# EAGLE design Circlez8a_v2 (EAGLE 6.3)
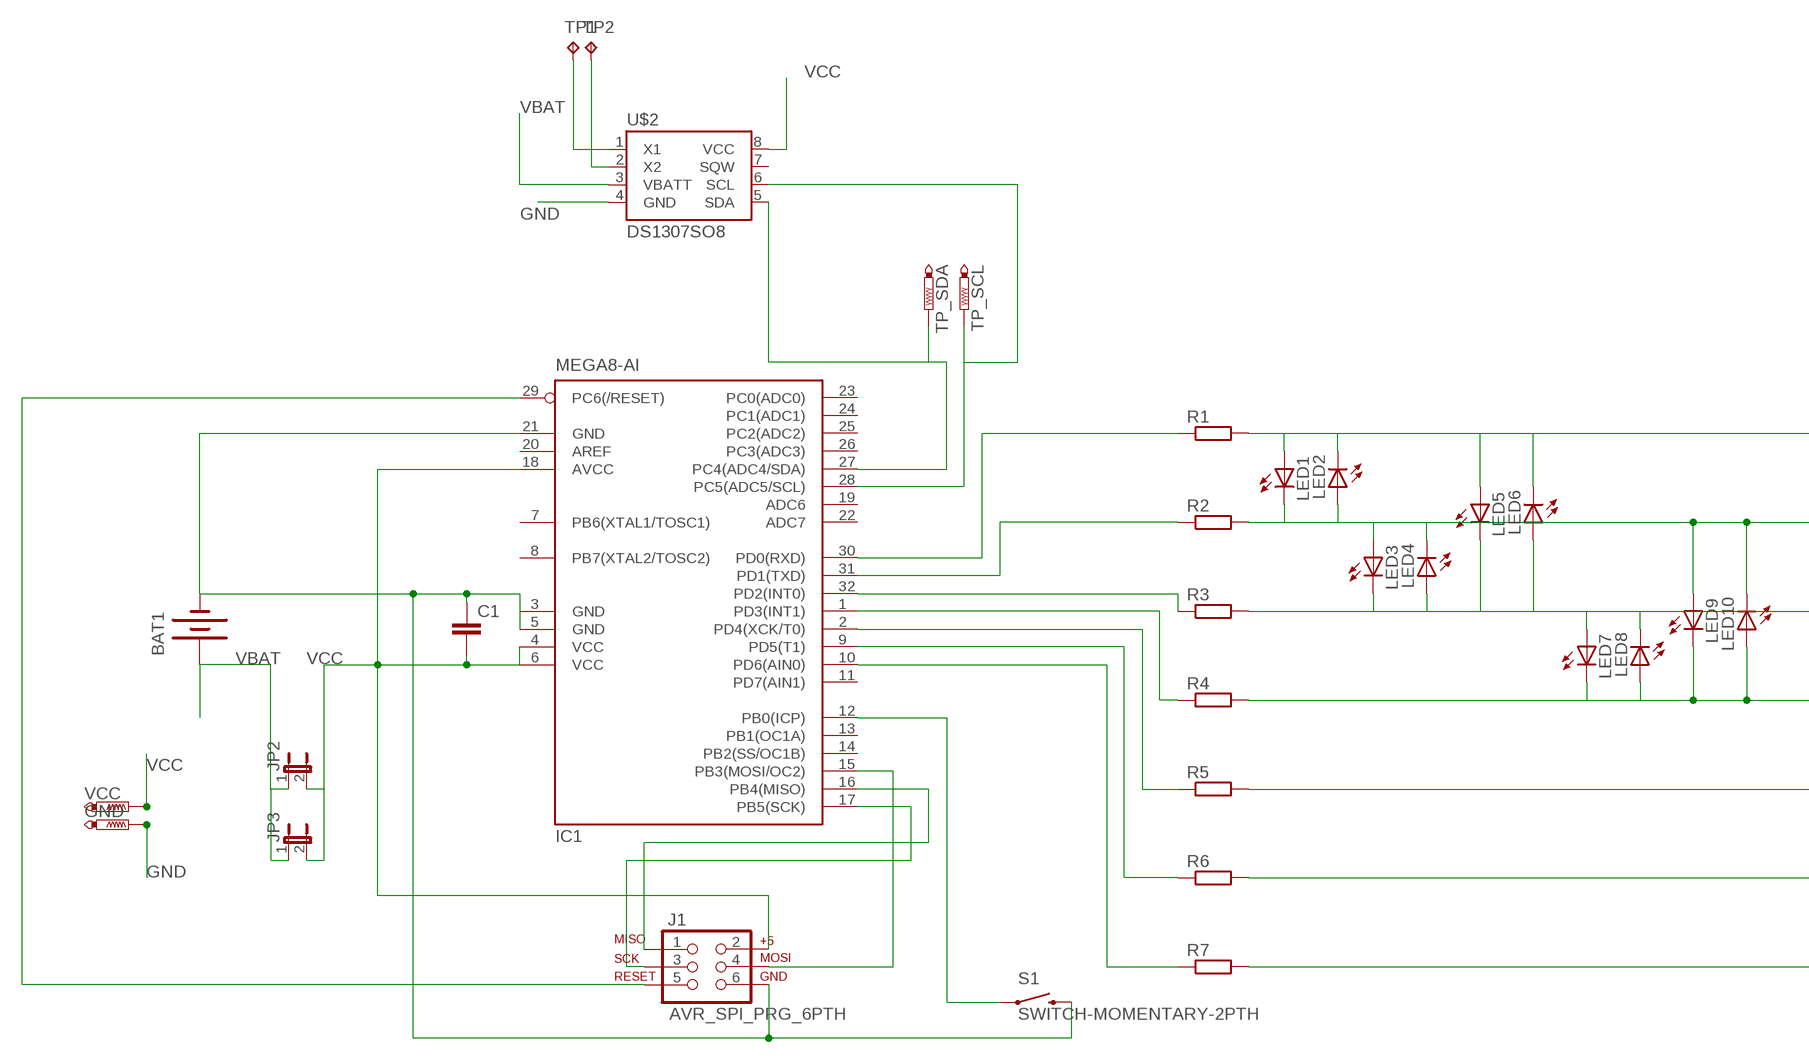
[diagram p0: schematic, sheet 1, part 1 of 2]
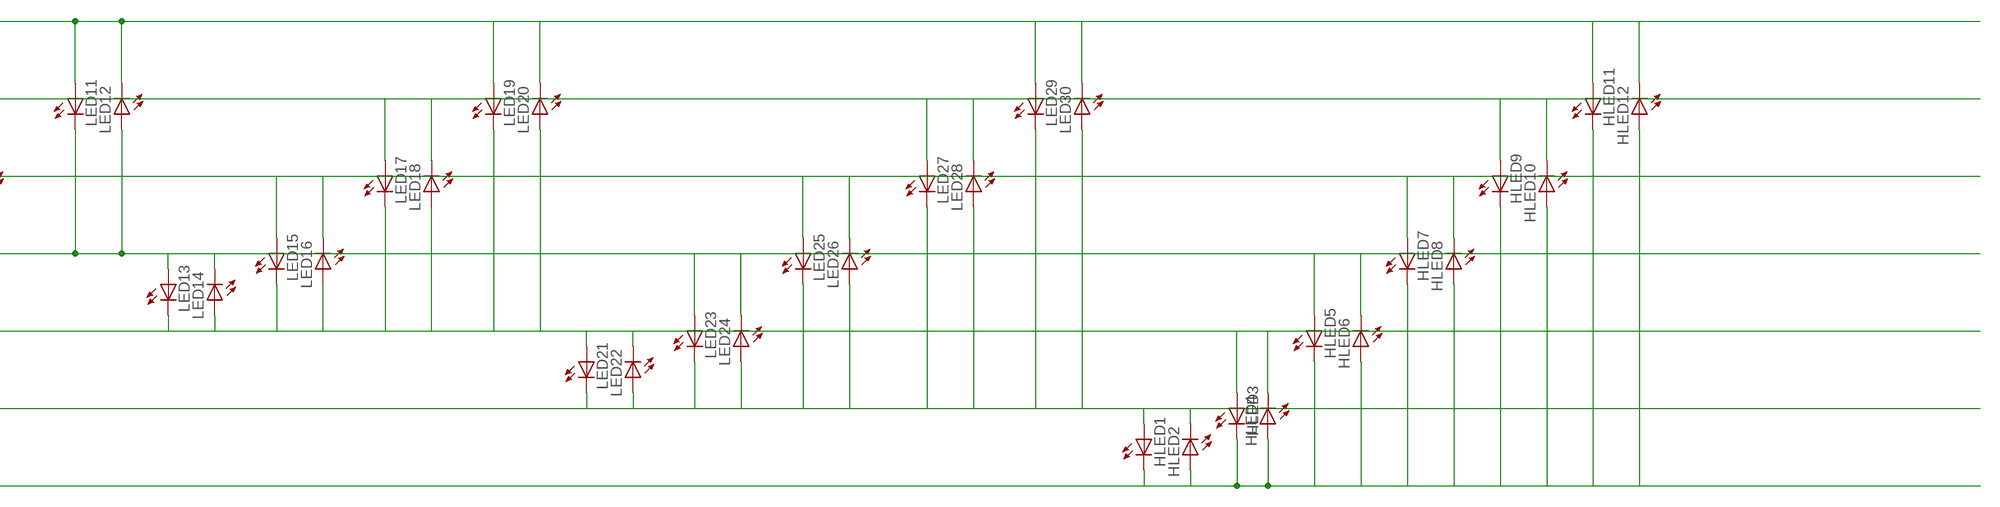
[diagram p1: schematic, sheet 1, part 2 of 2]

## Parts
BAT1  BATTERY20PTH  [BATTCOM_20MM_PTH]
C1  C-EU025-024X044  [C025-024X044]
GND  PTR1TP15SQ  [TP15SQ]
HLED1  LEDCHIP-LED0603  [CHIP-LED0603]
HLED2  LEDCHIP-LED0603  [CHIP-LED0603]
HLED3  LEDCHIP-LED0603  [CHIP-LED0603]
HLED4  LEDCHIP-LED0603  [CHIP-LED0603]
HLED5  LEDCHIP-LED0603  [CHIP-LED0603]
HLED6  LEDCHIP-LED0603  [CHIP-LED0603]
HLED7  LEDCHIP-LED0603  [CHIP-LED0603]
HLED8  LEDCHIP-LED0603  [CHIP-LED0603]
HLED9  LEDCHIP-LED0603  [CHIP-LED0603]
HLED10  LEDCHIP-LED0603  [CHIP-LED0603]
HLED11  LEDCHIP-LED0603  [CHIP-LED0603]
HLED12  LEDCHIP-LED0603  [CHIP-LED0603]
IC1  MEGA8-AI  [TQFP32-08]
J1  AVR_SPI_PRG_6PTH  [2X3]
JP2  JUMPER-2SMD-NO  [SJ_2S-NO]
JP3  JUMPER-2PTH  [1X02]
LED1  LEDCHIPLED_0603  [CHIPLED_0603]
LED2  LEDCHIPLED_0603  [CHIPLED_0603]
LED3  LEDCHIPLED_0603  [CHIPLED_0603]
LED4  LEDCHIPLED_0603  [CHIPLED_0603]
LED5  LEDCHIPLED_0603  [CHIPLED_0603]
LED6  LEDCHIPLED_0603  [CHIPLED_0603]
LED7  LEDCHIPLED_0603  [CHIPLED_0603]
LED8  LEDCHIPLED_0603  [CHIPLED_0603]
LED9  LEDCHIPLED_0603  [CHIPLED_0603]
LED10  LEDCHIPLED_0603  [CHIPLED_0603]
LED11  LEDCHIPLED_0603  [CHIPLED_0603]
LED12  LEDCHIPLED_0603  [CHIPLED_0603]
LED13  LEDCHIPLED_0603  [CHIPLED_0603]
LED14  LEDCHIPLED_0603  [CHIPLED_0603]
LED15  LEDCHIPLED_0603  [CHIPLED_0603]
LED16  LEDCHIPLED_0603  [CHIPLED_0603]
LED17  LEDCHIPLED_0603  [CHIPLED_0603]
LED18  LEDCHIPLED_0603  [CHIPLED_0603]
LED19  LEDCHIPLED_0603  [CHIPLED_0603]
LED20  LEDCHIPLED_0603  [CHIPLED_0603]
LED21  LEDCHIPLED_0603  [CHIPLED_0603]
LED22  LEDCHIPLED_0603  [CHIPLED_0603]
LED23  LEDCHIPLED_0603  [CHIPLED_0603]
LED24  LEDCHIPLED_0603  [CHIPLED_0603]
LED25  LEDCHIPLED_0603  [CHIPLED_0603]
LED26  LEDCHIPLED_0603  [CHIPLED_0603]
LED27  LEDCHIPLED_0603  [CHIPLED_0603]
LED28  LEDCHIPLED_0603  [CHIPLED_0603]
LED29  LEDCHIPLED_0603  [CHIPLED_0603]
LED30  LEDCHIPLED_0603  [CHIPLED_0603]
R1  R-EU_R1206  [R1206]
R2  R-EU_R1206  [R1206]
R3  R-EU_R1206  [R1206]
R4  R-EU_R1206  [R1206]
R5  R-EU_R1206  [R1206]
R6  R-EU_R1206  [R1206]
R7  R-EU_R1206  [R1206]
S1  SWITCH-MOMENTARY-2PTH  [TACTILE-PTH]
TP1  TPTP13SQ  [TP13SQ]
TP2  TPTP13SQ  [TP13SQ]
TP_SCL  PTR1TP09SQ  [TP09SQ]
TP_SDA  PTR1TP09SQ  [TP09SQ]
U$2  DS1307SO8  [SO08]
VCC  PTR1TP15SQ  [TP15SQ]

## Nets
GND: BAT1.2(-) C1.1 GND.TP IC1.3(GND) IC1.5(GND) IC1.21(GND) J1.6 S1.3 U$2.4(GND)
N$1: IC1.12(PB0(ICP)) S1.1
N$2: HLED11.A HLED12.C LED1.A LED2.C LED5.A LED6.C LED11.A LED12.C LED19.A LED20.C LED29.A LED30.C R1.2
N$3: IC1.16(PB4(MISO)) J1.1
N$4: IC1.17(PB5(SCK)) J1.3
N$5: IC1.15(PB3(MOSI/OC2)) J1.4
N$6: IC1.29(PC6(/RESET)) J1.5
N$8: HLED9.A HLED10.C LED1.C LED2.A LED3.A LED4.C LED9.A LED10.C LED17.A LED18.C LED27.A LED28.C R2.2
N$10: HLED5.A HLED6.C LED7.C LED8.A LED9.C LED10.A LED11.C LED12.A LED13.A LED14.C LED23.A LED24.C R4.2
N$11: HLED3.A HLED4.C LED13.C LED14.A LED15.C LED16.A LED17.C LED18.A LED19.C LED20.A LED21.A LED22.C R5.2
N$12: IC1.28(PC5(ADC5/SCL)) TP_SCL.TP U$2.6(SCL)
N$13: HLED1.A HLED2.C LED21.C LED22.A LED23.C LED24.A LED25.C LED26.A LED27.C LED28.A LED29.C LED30.A R6.2
N$14: HLED1.C HLED2.A HLED3.C HLED4.A HLED5.C HLED6.A HLED7.C HLED8.A HLED9.C HLED10.A HLED11.C HLED12.A R7.2
N$15: IC1.30(PD0(RXD)) R1.1
N$16: IC1.31(PD1(TXD)) R2.1
N$17: IC1.32(PD2(INT0)) R3.1
N$18: IC1.1(PD3(INT1)) R4.1
N$19: IC1.2(PD4(XCK/T0)) R5.1
N$20: IC1.9(PD5(T1)) R6.1
N$21: IC1.10(PD6(AIN0)) R7.1
N$22: TP1.TP U$2.1(X1)
N$23: TP2.TP U$2.2(X2)
N$24: IC1.27(PC4(ADC4/SDA)) TP_SDA.TP U$2.5(SDA)
N$27: HLED7.A HLED8.C LED3.C LED4.A LED5.C LED6.A LED7.A LED8.C LED15.A LED16.C LED25.A LED26.C R3.2
VBAT: BAT1.1(+) JP2.1 JP3.1 U$2.3(VBATT)
VCC: C1.2 IC1.4(VCC) IC1.6(VCC) IC1.18(AVCC) J1.2 JP2.2 JP3.2 U$2.8(VCC) VCC.TP
Unconnected: IC1.7(PB6(XTAL1/TOSC1)) IC1.8(PB7(XTAL2/TOSC2)) IC1.11(PD7(AIN1)) IC1.13(PB1(OC1A)) IC1.14(PB2(SS/OC1B)) IC1.19(ADC6) IC1.20(AREF) IC1.22(ADC7) IC1.23(PC0(ADC0)) IC1.24(PC1(ADC1)) IC1.25(PC2(ADC2)) IC1.26(PC3(ADC3)) U$2.7(SQW)

## Library data of the parts
BAT1 = SparkFun:BATTERY: Battery Holders Various common sizes : AA, AAA, 20mm coin cell and 12mm coin cell.
C1 = resistor:C-EU: CAPACITOR, European symbol
GND TP_SCL TP_SDA VCC = testpad:PTR1: TEST PIN
HLED1-HLED12 LED1-LED30 = led:LED: LED OSRAM: - CHIPLED LG R971, LG N971, LY N971, LG Q971, LY Q971, LO R971, LY R971 LH N974, LH R974 LS Q976, LO Q976, LY Q976 LO Q996 - Hyper CHIPLED LW Q18S LB Q993, LB Q99A, LB R99A - SideLED LS A670, LO A670, LY A670, LG A670, LP A670 LB A673, LV A673, LT A673, LW A673 LH A674 LY A675 LS A676, LA A676, LO A676, LY A676, LW A676 LS A679, LY A679, LG A679 - Hyper Micro SIDELED® LS Y876, LA Y876, LO Y876, LY Y876 LT Y87S - SmartLED LW L88C, LW L88S LB L89C, LB L89S, LG L890 LS L89K, LO L89K, LY L89K LS L896, LA L896, LO L896, LY L896 - TOPLED LS T670, LO T670, LY T670, LG T670, LP T670 LSG T670, LSP T670, LSY T670, LOP T670, LYG T670 LG T671, LOG T671, LSG T671 LB T673, LV T673, LT T673, LW T673 LH T674 LS T676, LA T676, LO T676, LY T676, LB T676, LH T676, LSB T676, LW T676 LB T67C, LV T67C, LT T67C, LS T67K, LO T67K, LY T67K, LW E67C LS E67B, LA E67B, LO E67B, LY E67B, LB E67C, LV E67C, LT E67C LW T67C LS T679, LY T679, LG T679 LS T770, LO T770, LY T770, LG T770, LP T770 LB T773, LV T773, LT T773, LW T773 LH T774 LS E675, LA E675, LY E675, LS T675 LS T776, LA T776, LO T776, LY T776, LB T776 LHGB T686 LT T68C, LB T68C - Hyper Mini TOPLED® LB M676 - Mini TOPLED Santana® LG M470 LS M47K, LO M47K, LY M47K Source: http://www.osram.convergy.de LUXEON: - LUMILED® LXK2-PW12-R00, LXK2-PW12-S00, LXK2-PW14-U00, LXK2-PW14-V00 LXK2-PM12-R00, LXK2-PM12-S00, LXK2-PM14-U00 LXK2-PE12-Q00, LXK2-PE12-R00, LXK2-PE12-S00, LXK2-PE14-T00, LXK2-PE14-U00 LXK2-PB12-K00, LXK2-PB12-L00, LXK2-PB12-M00, LXK2-PB14-N00, LXK2-PB14-P00, LXK2-PB14-Q00 LXK2-PR12-L00, LXK2-PR12-M00, LXK2-PR14-Q00, LXK2-PR14-R00 LXK2-PD12-Q00, LXK2-PD12-R00, LXK2-PD12-S00 LXK2-PH12-R00, LXK2-PH12-S00 LXK2-PL12-P00, LXK2-PL12-Q00, LXK2-PL12-R00 Source: www.luxeon.com KINGBRIGHT: KA-3528ASYC Source: www.kingbright.com
IC1 = atmel:MEGA8: MICROCONTROLLER 8 Kbytes FLASH, 1 kbytes SRAM, 512 bytes EEPROM, USART, 6-channel 10 bit ADC, 2-channel 8 bit ADC Pin compatible with Atmega48, ATMega88, ATMega168 Source: avr.lbr; MPN: ATMEGA8-16AU; OC_FARNELL: 9171371; OC_NEWARK: 73M8863
J1 = SparkFun-Connectors:AVR_SPI_PRG_6: AVR ISP 6 Pin This is the reduced ISP connector for AVR programming. Common on Arduino. This footprint will take up less PCB space and can be used with a 10-pin to 6-pin adapter such as SKU: BOB-08508
JP2 JP3 = SparkFun-Passives:JUMPER-2: Jumper Basic 0.1" spaced jumper. Use with breakaway headers.
R1-R7 = resistor:R-EU_: RESISTOR, European symbol
S1 = SparkFun-Electromechanical:SWITCH-MOMENTARY-2: Various NO switches- pushbuttons, reed, etc
TP1 TP2 = testpad:TP: Test pad
U$2 = SparkFun-FreqCtrl:DS1307: I2C real-time clock with battery backup.

## Board
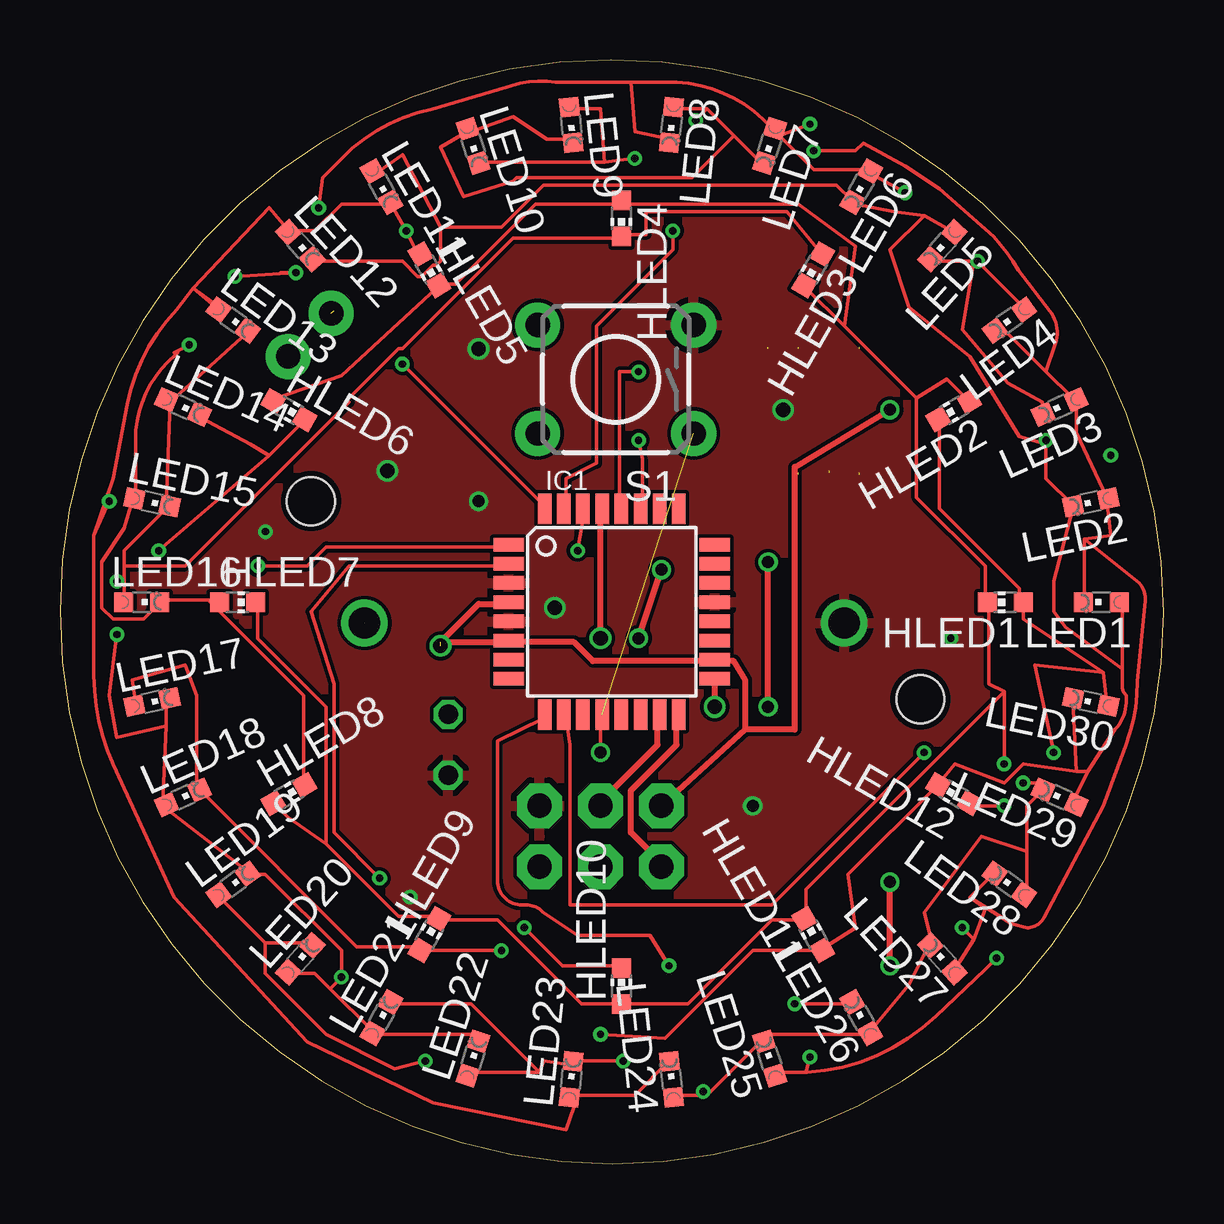
[diagram p2: board, top side]
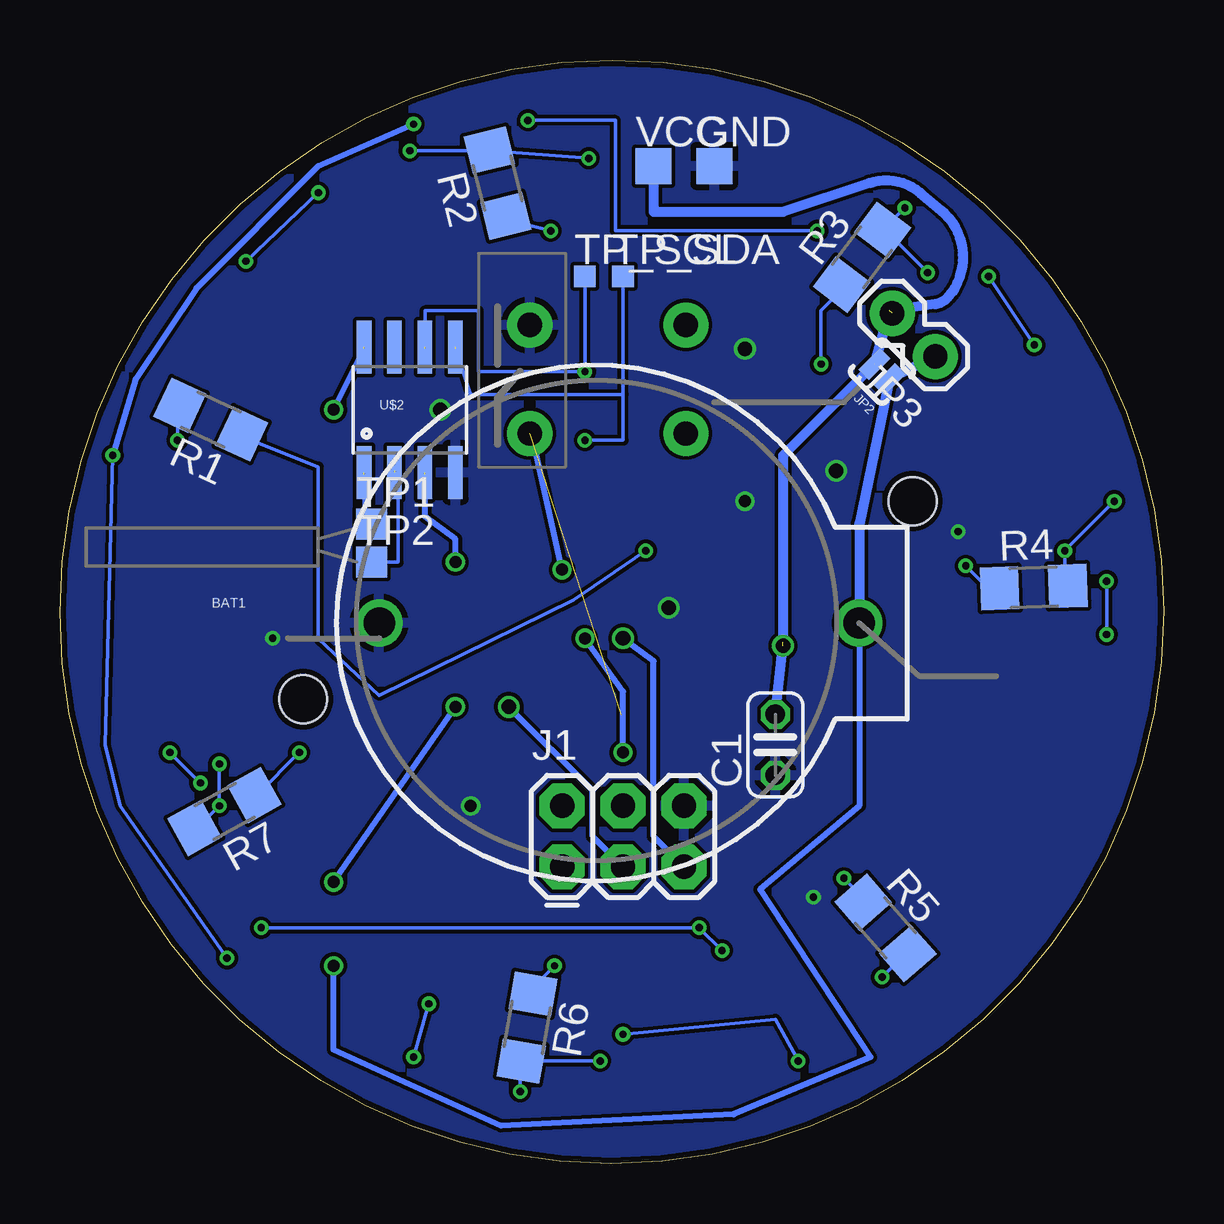
[diagram p3: board, bottom side, seen from below]

Size 46 x 46 mm. Coordinates in mm from the lower left corner, seen from the top.
Outline: 0,23.03 arc90 23.03,0 arc90 46,22.97 arc90 22.97,46 arc90 0,23.03
Copper layers (1*2*15*16): Top 0.035mm / dielectric 0.2mm / layer 2 0.0175mm / dielectric 1.1mm / layer 15 0.0175mm / dielectric 0.2mm / Bottom 0.035mm
Design rules "SeeedStudio_DRU_no_angle_20130527": minimum track width 6mil, minimum drill 12mil, track to track 6mil, track to pad 6mil, pad to pad 6mil, via to via 6mil, smd to smd 0mil, copper to edge 10mil, drill to drill 10mil, minimum pad ring 6mil, minimum via ring 6mil, stop-mask expansion 2mil, vias tented up to drill 25mil, thermal gap 10mil
Holes 2 mm at 35.87,19.35 10.46,27.61

### Footprints (pad centres in the part's own frame; a part is rotated, then mirrored left to right if it is on the bottom)
BATTCOM_20MM_PTH = drill 1.3: 1 20,0; 2 0,0
C025-024X044 = drill 0.813 octagon: 1 -1.27,0; 2 1.27,0
TP15SQ = smd 1.5 x 1.5: TP 0,0
CHIP-LED0603 = smd 0.8 x 0.8: A 0,-0.75; C 0,0.75
TQFP32-08 = smd 1.27 x 0.559: 1 -4.293,2.8; 2 -4.293,2; 3 -4.293,1.2; 4 -4.293,0.4; 5 -4.293,-0.4; 6 -4.293,-1.2; 7 -4.293,-2; 8 -4.293,-2.8; 17 4.293,-2.8; 18 4.293,-2; 19 4.293,-1.2; 20 4.293,-0.4; 21 4.293,0.4; 22 4.293,1.2; 23 4.293,2; 24 4.293,2.8 | smd 0.559 x 1.27: 9 -2.8,-4.293; 10 -2,-4.293; 11 -1.2,-4.293; 12 -0.4,-4.293; 13 0.4,-4.293; 14 1.2,-4.293; 15 2,-4.293; 16 2.8,-4.293; 25 2.8,4.293; 26 2,4.293; 27 1.2,4.293; 28 0.4,4.293; 29 -0.4,4.293; 30 -1.2,4.293; 31 -2,4.293; 32 -2.8,4.293
2X3 = drill 1.016 pad 1.88 octagon: 1 0,0; 2 0,2.54; 3 2.54,0; 4 2.54,2.54; 5 5.08,0; 6 5.08,2.54
SJ_2S-NO = smd 0.635 x 1.27: 1 -0.45,0; 2 0.45,0
1X02 = drill 1.016 pad 1.88: 1 0,0; 2 2.54,0
CHIPLED_0603 = smd 0.8 x 0.8: A 0,-0.75; C 0,0.75
R1206 = smd 1.6 x 1.803: 1 -1.422,0; 2 1.422,0
TACTILE-PTH = drill 1.016 pad 1.88: 1 -3.251,2.261; 2 3.251,2.261; 3 -3.251,-2.261; 4 3.251,-2.261
TP13SQ = smd 1.3 x 1.3: TP 0,0
TP09SQ = smd 0.9 x 0.9: TP 0,0
SO08 = smd 0.61 x 2.21: 1 -1.905,-2.616; 2 -0.635,-2.616; 3 0.635,-2.616; 4 1.905,-2.616; 5 1.905,2.616; 6 0.635,2.616; 7 -0.635,2.616; 8 -1.905,2.616

### Placement (x,y rotation side)
BAT1  32.69,22.53 0 bottom
C1  16.18,17.45 90 bottom
GND  18.72,41.58 0 bottom
HLED1  39.4,23.4 90 top
HLED2  37.26,31.4 120 top
HLED3  31.4,37.26 150 top
HLED4  23.4,39.4 180 top
HLED5  15.4,37.26 210 top
HLED6  9.54,31.4 240 top
HLED7  7.4,23.4 270 top
HLED8  9.54,15.4 300 top
HLED9  15.4,9.54 330 top
HLED10  23.4,7.4 0 top
HLED11  31.4,9.54 30 top
HLED12  37.26,15.4 60 top
IC1  23,23 0 top
J1  25.07,12.37 0 bottom
JP2  11.74,33.01 135 bottom
JP3  9.51,33.64 135 bottom
LED1  43.4,23.4 90 top
LED2  42.96,27.56 102 top
LED3  41.67,31.53 114 top
LED4  39.58,35.16 126 top
LED5  36.78,38.26 138 top
LED6  33.4,40.72 150 top
LED7  29.58,42.42 162 top
LED8  25.49,43.29 174 top
LED9  21.31,43.29 186 top
LED10  17.22,42.42 198 top
LED11  13.4,40.72 210 top
LED12  10.02,38.26 222 top
LED13  7.22,35.16 234 top
LED14  5.13,31.53 246 top
LED15  3.84,27.56 258 top
LED16  3.4,23.4 270 top
LED17  3.84,19.24 282 top
LED18  5.13,15.27 294 top
LED19  7.22,11.64 306 top
LED20  10.02,8.54 318 top
LED21  13.4,6.08 330 top
LED22  17.22,4.38 342 top
LED23  21.31,3.51 354 top
LED24  25.49,3.51 6 top
LED25  29.58,4.38 18 top
LED26  33.4,6.08 30 top
LED27  36.78,8.54 42 top
LED28  39.58,11.64 54 top
LED29  41.67,15.27 66 top
LED30  42.96,19.24 78 top
R1  39.71,31.01 155 bottom
R2  27.75,40.87 104 bottom
R3  12.57,37.78 53 bottom
R4  5.41,24.03 2 bottom
R5  11.59,9.82 311 bottom
R6  26.53,5.67 260 bottom
R7  39.14,14.67 209 bottom
S1  23.16,32.69 180 top
TP1  33.01,26.66 0 bottom
TP2  33.01,25.07 0 bottom
TP_SCL  24.12,36.98 0 bottom
TP_SDA  22.53,36.98 0 bottom
U$2  31.42,31.42 0 bottom
VCC  21.26,41.58 0 bottom

### Tracks (layer width: path | path; a pad name or v marks a point on that pad's centre or on a via)
GND  (via drill 0.3, 0.5, 0.6)
  other vias: 13.64,28.88 20.62,23.16 30.15,31.42 17.45,33.96 17.45,27.61 28.88,14.91 8.56,26.34 14.59,11.1 37.13,21.89
  pour Top: -4.14,83.49 105.08,83.49 105.08,-4.14 -5.41,-4.14
  pour Bottom: -9.22,82.22 103.81,83.49 102.54,-5.41 -9.22,-4.14
N$1  (1 unrouted)
N$2  (via drill 0.3)
  Top 0.152: 8.56,9.2 10.46,9.2 LED20.C | 8.56,9.2 6.66,11.1 LED19.A | 8.56,9.2 8.56,7.93 11.1,5.38 13.96,3.96 v15.23,4.27 | 15.86,39.04 15.86,37.61 15.7,37.45 15.54,37.45 15.07,36.98 14.91,36.98 14.28,37.61 10.62,37.61 LED12.C | 15.86,39.04 14.28,42.06 13.16,41.26 LED11.A | 36.02,39.52 37.13,38.88 LED5.A | 36.02,39.52 34.75,39.67 33.17,39.99 LED6.C 33.01,40.15 32.37,40.79 20.15,40.79 18.4,39.04 15.86,39.04 | 42.85,16.34 42.21,15.07 LED29.A | 42.85,16.34 42.37,16.34 | 42.37,16.34 42.21,19.35 LED30.C | 44.28,20.62 44.28,19.9 arc45 44.44,19.51 44.44,19.22 arc-45 43.97,18.09 42.85,16.34 | 44.28,20.62 44.28,23.32 LED1.A | 44.28,20.62 41.9,22.37 41.42,23.01 41.42,24.28 42.21,27.29 LED2.C 42.21,27.45 41.1,28.56 41.1,29.99 | 36.02,39.52 34.59,38.09 35.39,35.71 37.93,33.64 39.99,30.31 41.1,29.99 | 41.1,29.99 v41.1,30.15 | 42.37,16.34 40.15,16.66 39.36,15.86 37.29,16.66 36.66,15.86 HLED12.C 36.5,15.7 32.85,12.05 33.17,9.83 31.9,9.04 HLED11.A 31.74,8.88 28.88,8.88 25.23,5.23 v22.53,5.38
  Bottom 0.152: v41.1,30.15 41.1,31.58 R1.2 | v22.53,5.38 16.18,6.02 v15.23,4.27
N$3
  Top 0.254: J1.1 25.07,12.53 23.8,13.8 23.8,15.54 25.7,17.45 25.7,18.56 IC1.16
N$4  (via drill 0.61)
  Top 0.254: v27.29,19.04 27.29,20.15 IC1.17
  Bottom 0.254: v27.29,19.04 23.8,15.54 23.8,13.64 J1.3
N$5
  Top 0.254: J1.4 22.53,15.07 24.91,17.45 24.91,18.56 IC1.15
N$6  (via drill 0.61)
  Top 0.254: v22.53,21.89 22.53,27.29 IC1.29
  Bottom 0.254: v22.53,21.89 21.26,20.94 21.26,13.64 J1.5
N$7  (via drill 0.5)
  Top 0.152: v22.53,17.13 22.53,18.72
  Top 0.254: v24.12,21.89 v25.07,24.75
  Bottom 0.254: v22.53,17.13 22.53,19.67 v24.12,21.89 | v25.07,24.75 26.34,30.47
N$8  (via drill 0.3)
  Top 0.152: LED17.A 3.16,19.2 3,20.15 5.23,20.78 5.7,19.51 5.7,15.7 LED18.C 5.86,15.54 12.37,9.04 14.91,9.04 HLED9.A 15.07,8.88 v18.4,8.88 | v19.35,9.83 20.94,8.24 23.32,8.24 HLED10.C | 22.69,41.74 17.61,41.74 LED10.C | 22.69,41.74 22.53,43.96 21.26,43.96 LED9.A | 22.69,41.74 v23.96,41.9 | 38.09,9.35 38.56,10.62 37.93,11.1 | 38.09,9.35 37.29,8.08 LED27.A | 37.93,11.1 38.88,12.05 LED28.C | 42.69,26.02 43.8,26.18 43.64,27.61 LED2.A 43.64,27.77 42.37,30.47 42.37,31.74 LED3.A 42.21,31.9 41.1,33.01 | 42.69,26.02 42.69,23.48 LED1.C | 41.1,33.01 39.52,34.59 39.04,34.59 LED4.C | 37.93,11.1 39.67,9.99 40.32,9.83 arc61 41.01,10.24 43.48,14.91 44.43,17.43 arc21 44.91,20.09 45.23,23.47 arc45 45,24.19 42.69,26.02 | v31.42,42.21 33.17,42.21 33.48,42.53 35.23,41.58 36.66,40.63 38.92,38.63 arc-12 39.94,37.24 41.26,35.53 arc-56 41.49,34.17 41.1,33.01 | 38.09,9.35 v37.61,9.83
  Bottom 0.152: v18.4,8.88 v19.35,9.83 v37.61,9.83 | v23.96,41.9 28.09,42.21 R2.2 28.24,42.21 v31.42,42.21
N$10  (via drill 0.3)
  Top 0.152: 8.72,29.51 7.93,29.99 5.86,31.1 LED14.C | HLED6.C 10.15,30.94 8.72,29.51 | 8.72,29.51 v4.12,25.55 | 26.97,43.96 25.7,43.96 LED8.A | 28.09,42.85 29.2,41.74 LED7.C | 28.09,42.85 26.97,43.96 | LED24.C 25.39,4.27 23.96,2.85 21.26,2.85 LED23.A 21.1,2.69 21.42,2.37 21.1,1.42 15.54,2.53 10.31,5.07 4.75,11.1 2.22,16.64 arc-25 1.42,20.33 1.42,26.18 | LED9.C 21.26,42.69 20.31,42.69 18.88,43.64 17.13,43.01 LED10.A 16.97,43.01 15.86,42.37 16.81,40.31 18.88,40.95 19.04,41.1 26.34,41.1 28.09,42.85 | HLED5.A 14.91,37.93 v14.43,38.88 13.8,39.99 LED11.C 13.64,39.99 11.74,39.99 10.62,38.88 9.67,38.88 LED12.A 9.67,38.72 8.72,39.83 5.54,36.5 | 5.54,36.5 6.66,35.71 LED13.A 5.54,36.5 | 1.42,26.18 2.21,28.56 2.81,31.63 arc-33 4.87,35.59 5.54,36.5 | 1.42,26.18 v2.05,27.61 | v26.5,43.48 26.97,43.96
  Bottom 0.152: R4.2 4.12,24.12 v4.12,25.55 v2.05,27.61 | v14.43,38.88 22.85,38.88 22.85,43.48 v26.5,43.48
N$11  (via drill 0.3)
  Top 0.152: 4.43,18.24 4.43,19.35 LED17.C | 4.43,18.24 4.27,14.91 | 4.27,14.91 4.43,15.07 LED18.A | 4.27,14.91 7.77,12.21 LED19.C 7.93,12.05 8.56,12.05 11.74,8.88 v11.74,7.77 11.26,7.29 | LED22.C 17.45,5.23 17.29,5.38 13.16,5.38 LED21.A 13.01,5.54 11.26,7.29 | 11.26,7.29 10.62,7.93 9.67,7.93 LED20.A | HLED3.A 31.74,37.93 30.31,39.67 24.43,39.67 24.43,38.72 23.48,38.72 HLED4.C 23.32,38.56 18.88,38.56 14.28,33.96 14.12,33.96 11.89,31.74 12.05,31.74 5.23,24.91 2.69,24.91 | 2.69,24.91 2.69,25.55 4.43,27.29 LED15.C 4.43,27.45 4.59,31.74 | 2.69,24.91 2.69,24.28 | 2.69,24.28 2.69,23.48 LED16.A | 4.59,31.74 4.43,31.74 LED14.A | 4.59,31.74 7.77,34.59 LED13.C | 4.43,18.24 2.37,17.77 2.05,19.51 v2.37,22.05 | 2.69,24.28 v2.37,24.28
  Bottom 0.152: v11.74,7.77 10.78,8.72 R5.2 | v2.37,24.28 v2.37,22.05
N$12  (via drill 0.3)  (1 unrouted)
  Top 0.152: IC1.28 23.32,27.45 23.32,33.01 v24.12,33.01
  Bottom 0.152: TP_SCL.TP v24.12,33.01 28.56,33.01 28.56,35.55 30.78,35.55 30.78,33.96
N$13  (via drill 0.3)
  Top 0.152: 43.48,20.47 43.64,19.2 LED30.A | 43.48,20.47 40.15,22.69 40.15,23.32 HLED1.A 39.99,23.48 39.99,23.96 36.66,27.29 36.66,30.94 HLED2.C | 19.99,3.8 20.15,4.27 21.26,4.12 LED23.C 21.42,4.27 v23.48,4.27 | 19.99,3.8 17.13,3.8 LED22.A | 19.99,3.8 17.13,6.66 13.8,6.66 LED21.C | 40.31,13.01 40.31,14.91 40.95,15.54 LED29.C 40.95,15.7 40.79,15.86 v40.15,15.86 | 40.31,13.01 40.31,11.26 LED28.A | 26.82,2.85 26.97,2.85 29.2,5.07 LED25.C 29.36,5.23 29.51,5.38 33.64,5.38 LED26.A 33.8,5.54 35.39,7.45 36.18,9.04 LED27.C 36.34,9.2 36.02,10.46 38.41,13.64 40.31,13.01 | 26.82,2.85 25.7,2.85 LED24.A | 26.82,2.85 v26.82,3 | 43.48,20.47 40.63,20.78 v41.42,17.13
  Bottom 0.152: v26.82,3 26.82,4.12 R6.2 26.66,4.27 v23.48,4.27 | v40.15,15.86 v41.42,17.13
N$14  (via drill 0.3)
  Top 0.152: 11.1,13.32 14.12,10.31 15.7,10.31 HLED9.C 15.86,10.15 18.24,10.15 21.74,6.66 23.32,6.66 HLED10.A 23.48,6.66 26.18,6.66 29.67,10.15 30.94,10.15 HLED11.C 31.1,10.31 31.1,11.42 39.36,19.67 | 11.1,13.32 9.51,14.43 9.04,14.91 HLED8.A | 11.1,13.32 11.1,19.04 8.24,21.89 8.24,23.32 HLED7.C | HLED6.A 9.04,31.9 11.74,32.85 15.7,36.5 HLED5.C 15.86,36.66 16.5,36.66 19.83,39.99 23.32,39.99 HLED4.A 23.48,39.99 30.78,39.99 33.17,38.25 32.69,34.91 | v39.36,14.91 37.93,14.91 HLED12.A | 35.71,31.9 36.98,32.69 37.77,31.9 HLED2.A | 32.69,34.91 31.1,36.5 HLED3.C | 32.69,34.91 35.71,31.9 | 35.71,31.9 35.71,27.77 38.56,24.91 38.56,23.48 HLED1.C 38.72,23.32 38.72,19.99 39.36,19.67 | 39.36,19.67 v39.36,16.66
  Bottom 0.152: R7.2 40.31,13.96 v39.36,14.91 v39.36,16.66
N$15  (via drill 0.3)
  Top 0.152: v21.58,25.55 21.89,27.29 IC1.30
  Bottom 0.152: v21.58,25.55 24.59,23.48 32.69,19.51 35.23,21.89 35.23,29.04 38.41,30.31 R1.1
N$16  (via drill 0.3)
  Top 0.152: v25.55,38.88 25.55,38.09 22.37,34.91 22.37,29.2 21.1,28.56 21.1,27.45 IC1.31
  Bottom 0.152: v25.55,38.88 27.45,39.36 R2.1
N$17  (via drill 0.3)
  Top 0.152: v14.28,33.32 20.15,27.45 IC1.32
  Bottom 0.152: v14.28,33.32 14.28,35.55 13.32,36.5 R3.1
N$18  (via drill 0.3)
  Top 0.152: v8.24,24.91 10.31,24.91 11.1,25.7 18.56,25.7 IC1.1
  Bottom 0.152: v8.24,24.91 7.45,24.12 6.97,24.12 R4.1
N$19  (via drill 0.3)
  Top 0.152: v13.32,11.89 11.42,13.8 11.42,19.99 10.46,23.01 12.05,24.91 18.56,24.91 IC1.2
  Bottom 0.152: v13.32,11.89 12.37,10.94 R5.1
N$20  (via drill 0.3)
  Top 0.152: v25.39,8.24 24.59,9.51 21.58,9.51 20.11,10.5 arc45 19.43,10.78 19.25,10.78 arc-90 18.24,11.79 18.24,17.61 20.15,18.56 IC1.9
  Bottom 0.152: v25.39,8.24 26.18,7.45 26.18,7.13 R6.1
N$21  (via drill 0.3)
  Top 0.152: v36.02,17.13 29.67,10.78 21.26,10.78 21.26,17.45 21.1,18.56 IC1.10
  Bottom 0.152: v36.02,17.13 37.77,15.39 R7.1
N$22  (1 unrouted)
  Bottom 0.152: TP1.TP 33.32,27.45 33.32,28.72
N$23  (1 unrouted)
  Bottom 0.152: TP2.TP 31.9,25.07 31.9,28.56 32.05,28.88
N$24  (via drill 0.3)  (1 unrouted)
  Top 0.152: IC1.27 24.28,27.45 24.28,29.36 v24.12,30.15
  Bottom 0.152: 29.51,33.96 28.88,32.05 22.53,32.05 | v24.12,30.15 22.53,30.15 22.53,32.05 | 22.53,32.05 TP_SDA.TP
N$27  (via drill 0.3)
  Top 0.152: 6.18,23.48 6.5,23.48 HLED7.A | 6.18,23.48 4.27,23.48 LED16.C 4.12,23.32 3.48,22.69 2.21,22.69 1.73,23.16 1.73,25.07 2.69,26.5 3,27.61 LED15.A 3.16,27.77 3.16,30.55 arc-45 4.8,33.69 4.91,33.8 4.75,33.8 v5.38,34.12 | 6.18,23.48 10.15,19.51 10.15,15.86 HLED8.C | 9.2,37.13 v9.83,37.13 v7.29,36.98 | v30.63,6.66 33.01,6.66 LED26.C | 29.67,3.64 LED25.A 29.83,3.8 31.1,3.8 | 38.09,37.61 v38.25,37.61 40.15,35.71 LED4.A | 38.09,37.61 36.34,37.61 LED5.C | 38.09,37.61 37.61,34.75 39.52,32.53 40.95,31.74 40.95,31.26 LED3.C | 23.8,45.07 23.96,43.01 24.75,42.85 25.39,42.69 LED8.C | LED7.A 29.67,43.17 29.66,43.18 arc45 25.7,45.07 23.8,45.07 | 29.99,42.85 29.83,43.01 LED7.A | 29.99,42.85 31.42,41.42 33.64,41.42 LED6.A 33.8,41.26 v35.23,40.47 | 31.1,3.8 31.13,3.8 arc40 36.52,6.14 38.56,8.08 v39.04,8.56 | 29.99,42.85 v31.26,43.33 | 29.99,42.85 LED7.A | v10.78,39.83 10.94,41.1 11.73,41.89 arc-34 15.5,43.95 19.18,45.04 arc-16 20.66,45.07 23.8,45.07 | v31.26,4.43 31.1,3.8
  Bottom 0.152: v9.83,37.13 11.58,38.88 R3.2 11.58,39.04 v10.78,39.83 | v43.8,29.51 44.12,17.45 43.48,14.91 v39.04,8.56 | v35.23,40.47 v38.25,37.61 | v30.63,6.66 v31.26,4.43 | v5.38,34.12 v7.29,36.98
  Bottom 0.254: v31.26,43.33 35.23,41.58 40.31,36.5 42.85,32.69 v43.8,29.51
VBAT  (via drill 0.5)  (3 unrouted)
  Top 0.254: v34.59,8.24 v34.59,11.74 | v29.51,19.04 v29.51,25.07
  Bottom 0.254: BAT1.1 12.69,14.91 16.81,11.42 12.21,4.43 17.93,2.05 27.61,1.57 34.59,4.75 v34.59,8.24 | v34.59,11.74 v29.51,19.04 | v29.51,25.07 29.51,26.02 30.78,26.97 30.78,28.72
  Bottom 0.406: JP3.1 JP2.1 12.69,26.66 BAT1.1
VCC  (via drill 0.5, 0.6)  (4 unrouted)
  Top 0.254: IC1.4 18.56,23.32 17.45,23.32 15.86,21.74 18.56,21.74 IC1.6 18.72,21.74 21.42,21.74 22.21,20.94 27.29,20.94 IC1.18 27.45,20.94 28.09,20.94 28.56,20.15 28.56,18.08 | J1.2 28.56,18.08 | v34.59,31.42 30.63,29.04 30.63,18.08 28.56,18.08
  Bottom 0.254: v34.59,31.42 33.32,33.96
  Bottom 0.406: C1.2 v15.86,21.58 15.86,29.51 JP2.2 11.42,35.55 9.52,35.82 arc-41 8.98,36.12 arc-91 9.28,39.75 10.15,40.47 arc-58 12.28,40.87 15.86,39.67 21.26,39.67 VCC.TP

### Text on the board
Document: ATmega8a
bDocu: GND | VCC / 5v | SDA | SCL | PB0 | VCC=VBAT | DS1307 | Crystal 32kHz | GND | VBAT | ISP | March2014 | Circlez v2.0 | http://kalshagar.wikispaces.com/Circlez